# Altium schematic sheet Arduino Nano Pinouts.SchDoc
size A
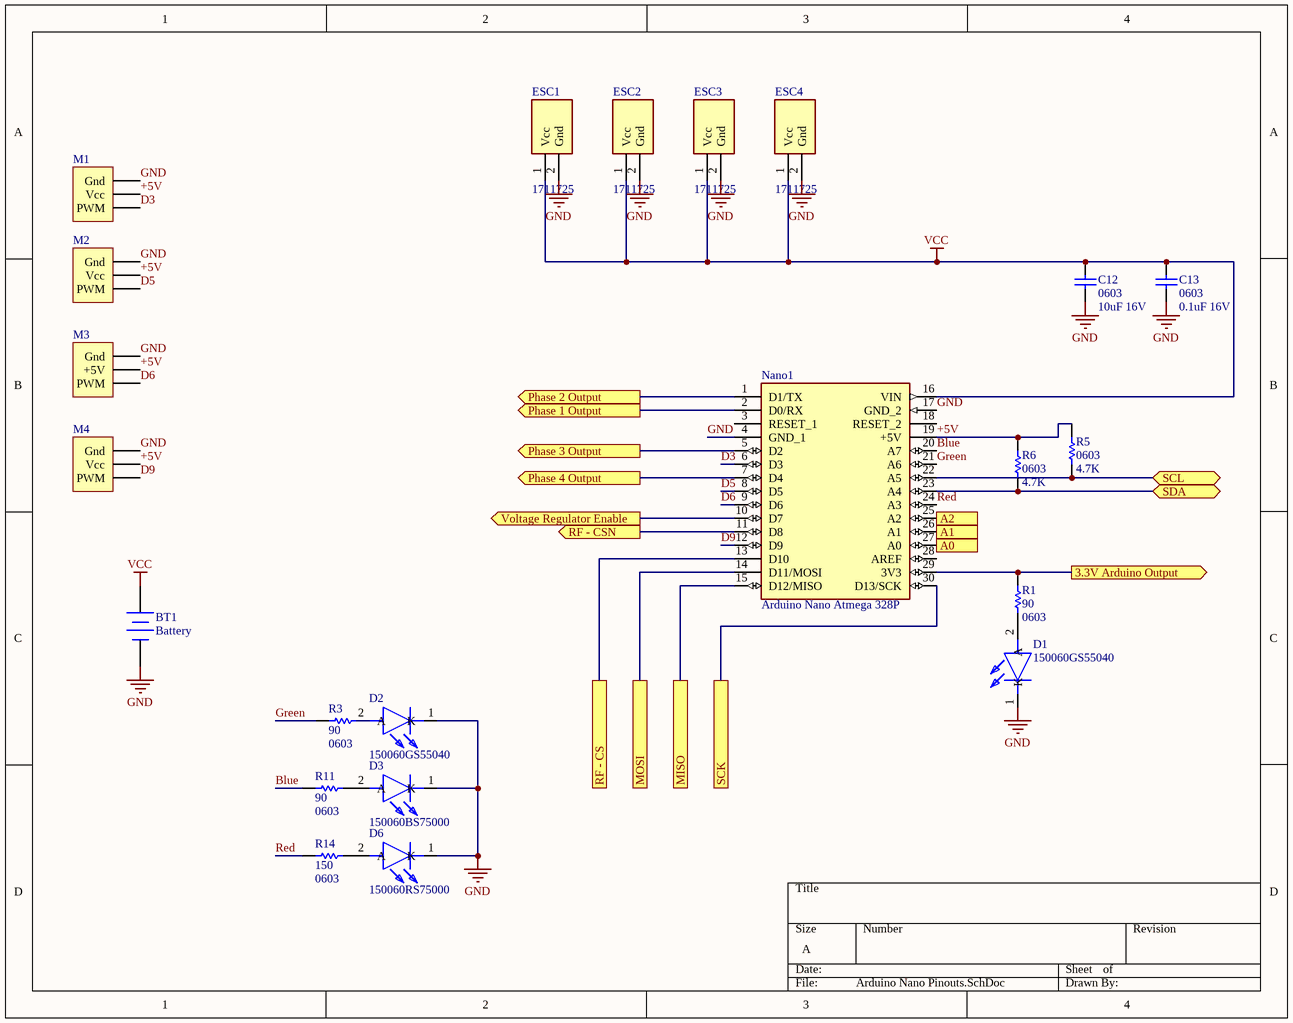
[diagram p0: Arduino Nano Pinouts.SchDoc]

## Parts
BT1  Battery  [12AWGBATTCONNECTOR]
C12  0603  value 10uF 16V  [SMD-0603C]
C13  0603  value 0.1uF 16V  [SMD-0603C]
D1  150060GS55040  [LEDC1608X50N]
D2  150060GS55040  [LEDC1608X50N]
D3  150060BS75000  [LEDC1608X80N]
D6  150060RS75000  [LEDC1608X80N]
ESC1  1711725  [PHEONIX-5.08PITCH-2PIN]
ESC2  1711725  [PHEONIX-5.08PITCH-2PIN]
ESC3  1711725  [PHEONIX-5.08PITCH-2PIN]
ESC4  1711725  [PHEONIX-5.08PITCH-2PIN]
M1  (no value)  [*TE_3-644695-3]
M2  (no value)  [*TE_3-644695-3]
M3  (no value)  [*TE_3-644695-3]
M4  (no value)  [*TE_3-644695-3]
Nano1  Arduino Nano Atmega 328P  [ARDNanoINV]
R1  90  value 0603  [SMD-0603-RES]
R3  90  value 0603  [SMD-0603-RES]
R5  0603  value 4.7K  [SMD-0603C]
R6  0603  value 4.7K  [SMD-0603-RES]
R11  90  value 0603  [SMD-0603-RES]
R14  150  value 0603  [SMD-0603-RES]

## Ports
3.3V Arduino Output (out), A0 (in), A1 (in), A2 (in), MISO, MOSI, Phase 1 Output (out), Phase 2 Output (out), Phase 3 Output (out), Phase 4 Output (out), RF - CS, RF - CSN (out), SCK, SCL (bidir), SDA (bidir), Voltage Regulator Enable (out)

## Nets
GND: BT1.2(-) C12.1 C13.1 D1.1(K) D2.1(K) D3.1(K) D6.1(K) ESC1.2(Gnd) ESC2.2(Gnd) ESC3.2(Gnd) ESC4.2(Gnd) M1.3(Gnd) M2.3(Gnd) M3.3(Gnd) M4.3(Gnd) Nano1.4(GND_1) Nano1.17(GND_2)
VCC: BT1.1(+) C12.2 C13.2 ESC1.1(Vcc) ESC2.1(Vcc) ESC3.1(Vcc) ESC4.1(Vcc) Nano1.16(VIN)
3.3V Arduino Output: Nano1.29(3V3) R1.1 ; port 3.3V Arduino Output
+5V: M1.2(Vcc) M2.2(Vcc) M3.2(+5V) M4.2(Vcc) Nano1.19(+5V) R5.2 R6.2
A0: Nano1.27(A0) ; port A0
A1: Nano1.26(A1) ; port A1
A2: Nano1.25(A2) ; port A2
Blue: Nano1.20(A7) R11.1
D3: M1.1(PWM) Nano1.6(D3)
D5: M2.1(PWM) Nano1.8(D5)
D6: M3.1(PWM) Nano1.9(D6)
D9: M4.1(PWM) Nano1.12(D9)
Green: Nano1.21(A6) R3.1
MISO: Nano1.15(D12/MISO) ; port MISO
MOSI: Nano1.14(D11/MOSI) ; port MOSI
Phase 1 Output: Nano1.2(D0/RX) ; port Phase 1 Output
Phase 2 Output: Nano1.1(D1/TX) ; port Phase 2 Output
Phase 3 Output: Nano1.5(D2) ; port Phase 3 Output
Phase 4 Output: Nano1.7(D4) ; port Phase 4 Output
Red: Nano1.24(A3) R14.1
RF - CS: Nano1.13(D10) ; port RF - CS
RF - CSN: Nano1.11(D8) ; port RF - CSN
SCK: Nano1.30(D13/SCK) ; port SCK
SCL: Nano1.22(A5) R5.1 ; port SCL
SDA: Nano1.23(A4) R6.1 ; port SDA
Voltage Regulator Enable: Nano1.10(D7) ; port Voltage Regulator Enable
NetD1_2: D1.2(A) R1.2
NetD2_2: D2.2(A) R3.2
NetD3_2: D3.2(A) R11.2
NetD6_2: D6.2(A) R14.2

Not connected (* = marked no-connect by the designer): Nano1 3(RESET_1) 18(RESET_2) 28(AREF)

## Library data of the parts
BT1 = Battery: Multicell Battery; Published: 24-Mar-1999; LatestRevisionDate: 17-Jul-2002; LatestRevisionNote: Re-released for DXP Platform.; PackageReference: BAT-2; Publisher: Altium Limited; PackageDescription: Battery; 2 Leads
C12 C13 = Cap: Capacitor; Published: 8-Jun-2000; LatestRevisionDate: 17-Jul-2002; LatestRevisionNote: Re-released for DXP Platform.; PackageReference: RAD-0.3; Publisher: Altium Limited; PackageDescription: Radial Cap, Thru-Hole; 2 Leads; 0.3 in Pin Spacing
D1 D2 = 150060GS55040: LED; Manufacturer_Name: Wurth Elektronik; Datasheet Link: https://katalog.we-online.de/led/datasheet/150060GS55040.pdf; Height: 0.5mm; Manufacturer_Part_Number: 150060GS55040; Mouser Part Number: 710-150060GS55040; Mouser Price/Stock: https://www.mouser.com/Search/Refine.aspx?Keyword=710-150060GS55040; RS Part Number: 1766068P; RS Price/Stock: http://uk.rs-online.com/web/p/products/1766068P
D3 = 150060BS75000: LED; Manufacturer_Name: Wurth Elektronik; Datasheet Link: https://componentsearchengine.com/Datasheets/2/150060BS75000.pdf; Height: 0.8mm; Manufacturer_Part_Number: 150060BS75000; Mouser Part Number: 710-150060BS75000; Mouser Price/Stock: https://www.mouser.com/Search/Refine.aspx?Keyword=710-150060BS75000; RS Part Number: 8154206P; RS Price/Stock: http://uk.rs-online.com/web/p/products/8154206P
D6 = 150060RS75000: LED; Manufacturer_Name: Wurth Elektronik; Datasheet Link: http://katalog.we-online.de/led/datasheet/150060RS75000.pdf; Height: 0.8mm; Manufacturer_Part_Number: 150060RS75000; Mouser Part Number: 710-150060RS75000; Mouser Price/Stock: https://www.mouser.com/Search/Refine.aspx?Keyword=710-150060RS75000; RS Part Number: 8154203P; RS Price/Stock: http://uk.rs-online.com/web/p/products/8154203P
ESC1-ESC4 = 1711725: Integrated Circuit; Manufacturer_Name: Phoenix Contact; Allied_Number: 70054425; Datasheet Link: http://docs-asia.electrocomponents.com/webdocs/1380/0900766b81380186.pdf; Manufacturer_Part_Number: 1711725; Mouser Part Number: 651-1711725; Mouser Price/Stock: https://www.mouser.com/Search/Refine.aspx?Keyword=651-1711725; RS Part Number: 1895843; RS Price/Stock: http://uk.rs-online.com/web/p/products/1895843; Allied Price/Stock: http://www.alliedelec.com/phoenix-contact-1711725/70054425/
M1-M4 = Header 3: Header, 3-Pin; LatestRevisionDate: 17-Jul-2002; LatestRevisionNote: Re-released for DXP Platform.; Publisher: Altium Limited
Nano1 = ARDNanoINV: Integrated Circuit; Datasheet Link: https://componentsearchengine.com/Datasheets/2/A000005.pdf; Height: 10.1mm; Manufacturer_Name: Arduino; Manufacturer_Part_Number: ARDNanoINV; Mouser Part Number: 992-ARD-NANO30; Mouser Price/Stock: http://www.mouser.com/Search/ProductDetail.aspx?qs=Vxac6xGyzPmCaTfvE003gg%3d%3d
R1 R3 R5 R6 R11 R14 = Res1: Resistor; Published: 8-Jun-2000; LatestRevisionDate: 17-Jul-2002; LatestRevisionNote: Re-released for DXP Platform.; PackageReference: AXIAL-0.3; Publisher: Altium Limited; PackageDescription: Axial Device, Thru-Hole; 2 Leads; 0.3 in Pin Spacing